# Altium schematic sheet Tiva_C_Base.SchDoc
size B
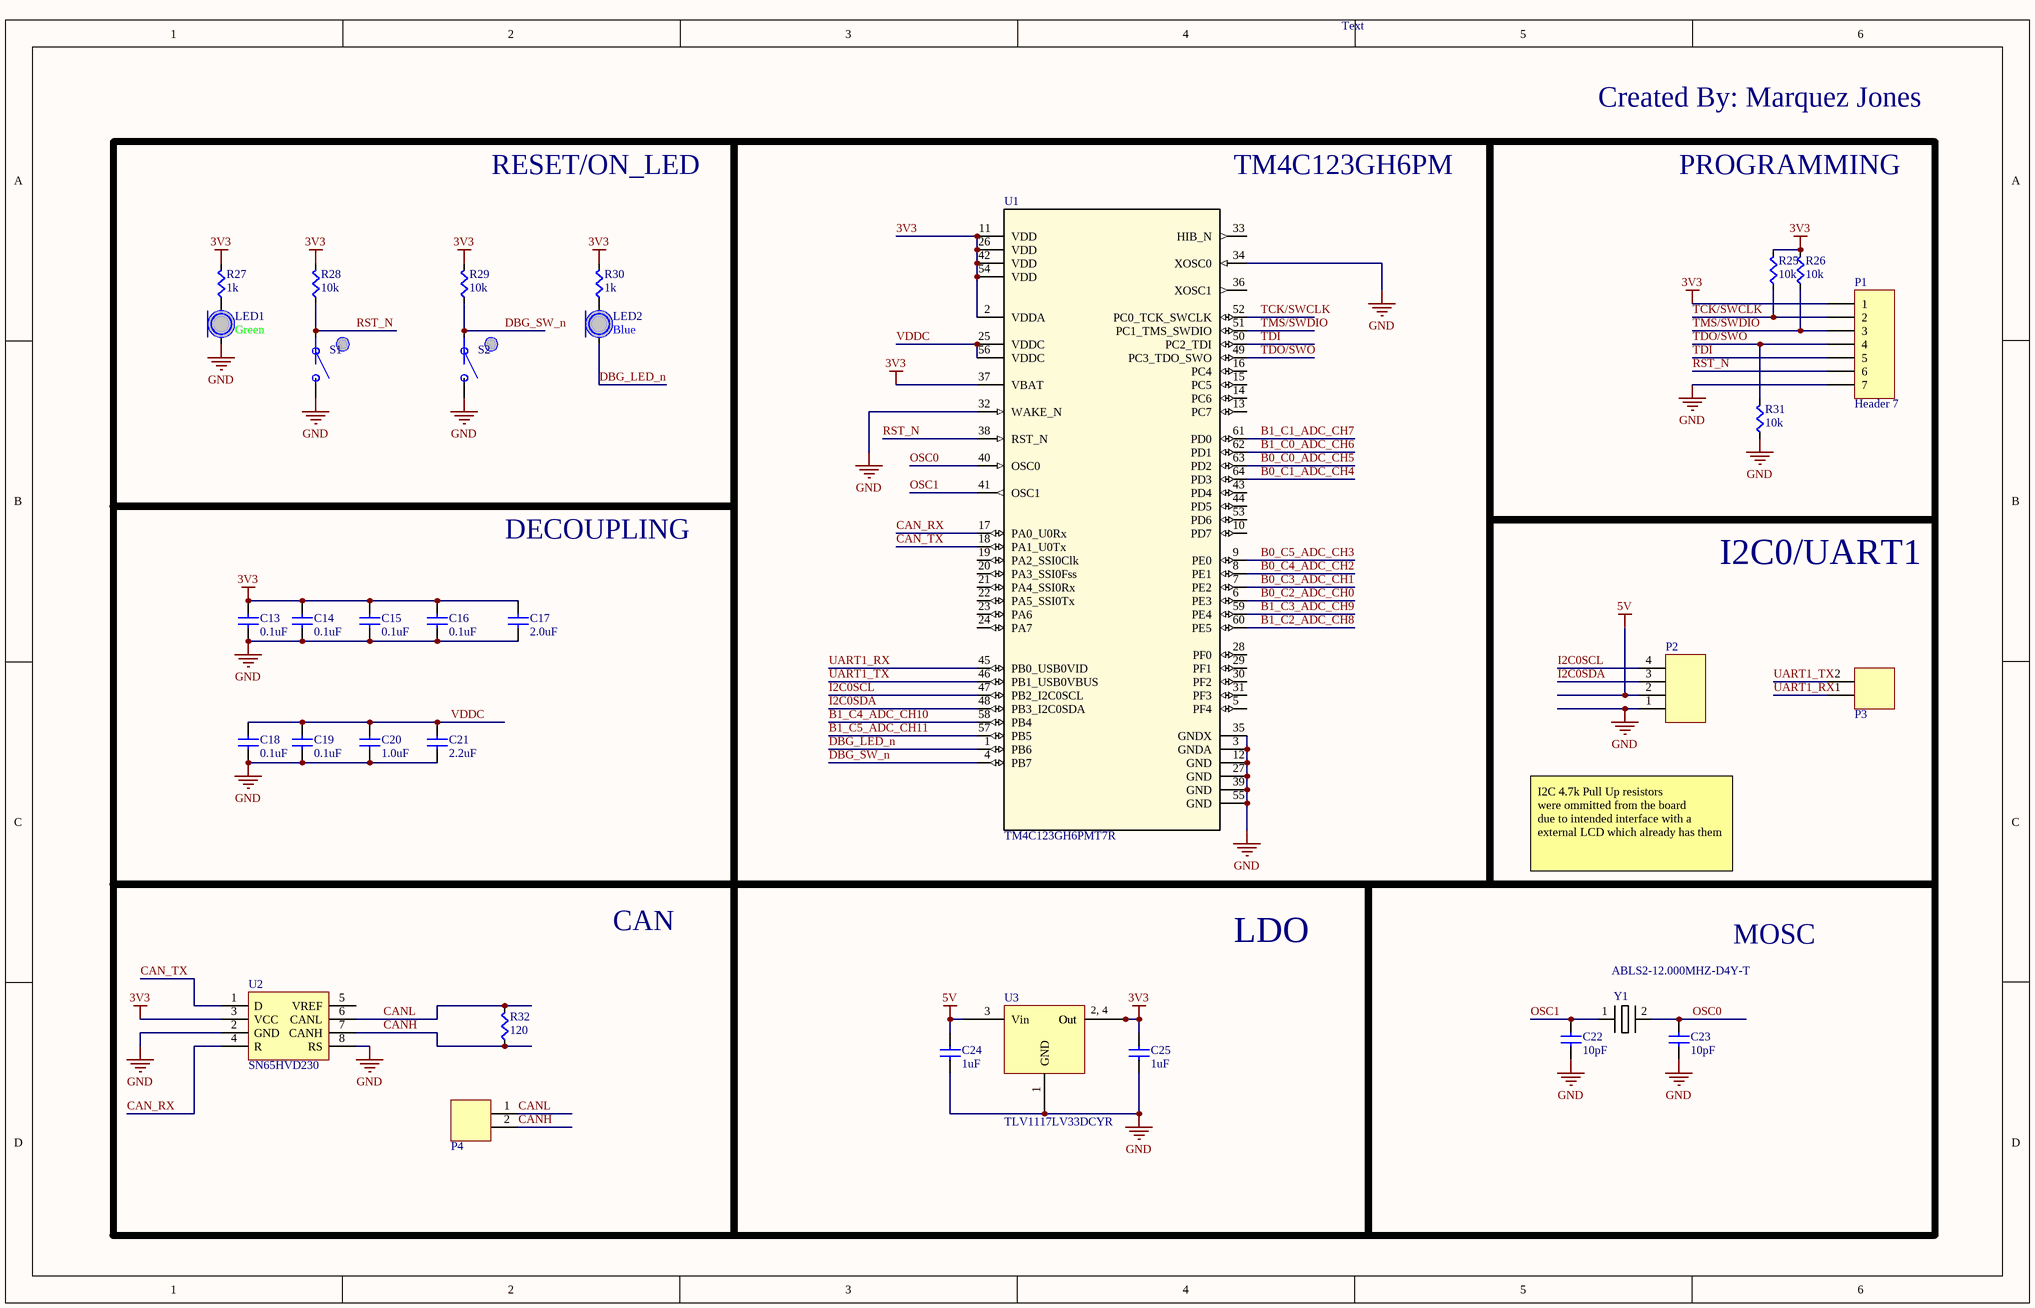
[diagram p0: Tiva_C_Base.SchDoc]

## Parts
C13  value 0.1uF  [CAPC0603]  (hidden comment: Cap)
C14  value 0.1uF  [CAPC0603]  (hidden comment: Cap)
C15  value 0.1uF  [CAPC0603]  (hidden comment: Cap)
C16  value 0.1uF  [CAPC0603]  (hidden comment: Cap)
C17  value 2.0uF  [CAPC0603]  (hidden comment: Cap)
C18  value 0.1uF  [CAPC0603]  (hidden comment: Cap)
C19  value 0.1uF  [CAPC0603]  (hidden comment: Cap)
C20  value 1.0uF  [CAPC0603]  (hidden comment: Cap)
C21  value 2.2uF  [CAPC0603]  (hidden comment: Cap)
C22  value 10pF  [CAPC0603]  (hidden comment: Cap)
C23  value 10pF  [CAPC0603]  (hidden comment: Cap)
C24  value 1uF  [CAPC0603]  (hidden comment: Cap)
C25  value 1uF  [CAPC0603]  (hidden comment: Cap)
LED1  Color: Green  [LED0603]  (hidden comment: LED)
LED2  Color: Blue  [LED0603]  (hidden comment: LED)
P1  Header 7  [HDR1X7]
P2  (no value)  [MOLEX-HDR-1X4-SHERLOCK-VERT]
P3  2-pin Vert Sherlock  [MOLEX-HDR-1X2-SHERLOCK-VERT]  (value not drawn)
P4  2-pin Vert Sherlock  [MOLEX-HDR-1X2-SHERLOCK-VERT]  (value not drawn)
R25  value 10k  [RES0603]  (hidden comment: Res)
R26  value 10k  [RES0603]  (hidden comment: Res)
R27  value 1k  [RES0603]  (hidden comment: Res)
R28  value 10k  [RES0603]  (hidden comment: Res)
R29  value 10k  [RES0603]  (hidden comment: Res)
R30  value 1k  [RES0603]  (hidden comment: Res)
R31  value 10k  [RES0603]  (hidden comment: Res)
R32  value 120  [RES0603]  (hidden comment: Res)
S1  Button  [PTS645xxxxSMTR92]  (value not drawn)
S2  Button  [PTS645xxxxSMTR92]  (value not drawn)
U1  TM4C123GH6PMT7R  [TM4C123GH6PMT7R_L]
U2  SN65HVD230  [SOIC-8pin]
U3  TLV1117LV33DCYR  [SOT23-4N]
Y1  ABLS2-12.000MHZ-D4Y-T  [HC49/US]

## Blocks framed on the sheet
RESET/ON_LED: LED1 LED2 R27-R30 S1 S2
TM4C123GH6PM: U1
PROGRAMMING: P1 R25 R26 R31
DECOUPLING: C13-C21
I2C0/UART1: P2 P3
CAN: P4 R32 U2
LDO: C24 C25 U3
MOSC: C22 C23 Y1

## Nets
3V3: C13.1(A) C14.1(A) C15.1(A) C16.1(A) C17.1(A) C25.1(A) P1.1 R25.1(A) R26.1(A) R27.1(A) R28.1(A) R29.1(A) R30.1(A) U1.2(VDDA) U1.11(VDD) U1.26(VDD) U1.37(VBAT) U1.42(VDD) U1.54(VDD) U2.3(VCC) U3.2(Out) U3.4(Out)
5V: C24.1(A) P2.2 U3.3(Vin)
GND: C13.2(B) C14.2(B) C15.2(B) C16.2(B) C17.2(B) C18.2(B) C19.2(B) C20.2(B) C21.2(B) C22.2(B) C23.2(B) C24.2(B) C25.2(B) LED1.C P1.7 P2.1 R31.2(B) S1.B S2.B U1.3(GNDA) U1.12(GND) U1.27(GND) U1.32(WAKE_N) U1.34(XOSC0) U1.35(GNDX) U1.39(GND) U1.55(GND) U2.2(GND) U2.8(RS) U3.1(GND)
B0_C0_ADC_CH5: U1.63(PD2)
B0_C1_ADC_CH4: U1.64(PD3)
B0_C2_ADC_CH0: U1.6(PE3)
B0_C3_ADC_CH1: U1.7(PE2)
B0_C4_ADC_CH2: U1.8(PE1)
B0_C5_ADC_CH3: U1.9(PE0)
B1_C0_ADC_CH6: U1.62(PD1)
B1_C1_ADC_CH7: U1.61(PD0)
B1_C2_ADC_CH8: U1.60(PE5)
B1_C3_ADC_CH9: U1.59(PE4)
B1_C4_ADC_CH10: U1.58(PB4)
B1_C5_ADC_CH11: U1.57(PB5)
CAN_RX: U1.17(PA0_U0Rx) U2.4(R)
CAN_TX: U1.18(PA1_U0Tx) U2.1(D)
CANH: P4.2 R32.2(B) U2.7(CANH)
CANL: P4.1 R32.1(A) U2.6(CANL)
DBG_LED_n: LED2.C U1.1(PB6)
DBG_SW_n: R29.2(B) S2.A U1.4(PB7)
I2C0SCL: P2.4 U1.47(PB2_I2C0SCL)
I2C0SDA: P2.3 U1.48(PB3_I2C0SDA)
OSC0: C23.1(A) U1.40(OSC0) Y1.2
OSC1: C22.1(A) U1.41(OSC1) Y1.1
RST_N: P1.6 R28.2(B) S1.A U1.38(RST_N)
TCK/SWCLK: P1.2 R25.2(B) U1.52(PC0_TCK_SWCLK)
TDI: P1.5 U1.50(PC2_TDI)
TDO/SWO: P1.4 R31.1(A) U1.49(PC3_TDO_SWO)
TMS/SWDIO: P1.3 R26.2(B) U1.51(PC1_TMS_SWDIO)
UART1_RX: P3.1 U1.45(PB0_USB0VID)
UART1_TX: P3.2 U1.46(PB1_USB0VBUS)
VDDC: C18.1(A) C19.1(A) C20.1(A) C21.1(A) U1.25(VDDC) U1.56(VDDC)
NetLED1_A: LED1.A R27.2(B)
NetLED2_A: LED2.A R30.2(B)

Not connected (* = marked no-connect by the designer): U1 5(PF4) 10(PD7) 13(PC7) 14(PC6) 15(PC5) 16(PC4) 19(PA2_SSI0Clk) 20(PA3_SSI0Fss) 21(PA4_SSI0Rx) 22(PA5_SSI0Tx) 23(PA6) 24(PA7) 28(PF0) 29(PF1) 30(PF2) 31(PF3) 33(HIB_N) 36(XOSC1) 43(PD4) 44(PD5) 53(PD6); U2 5(VREF)

## Notes on the sheet
- Text
- Created By: Marquez Jones
- I2C 4.7k Pull Up resistors
  were ommitted from the board
  due to intended interface with a
  external LCD which already has them
- (in symbol TLV1117LV33DCYR) 2, 4

## Library data of the parts
C24 C25 = Cap: Manufacturer Part Number: C0603C105K8PACTU; Supplier 1: Digi-Key; Supplier Part Number 1: 399-3118-1-ND
P1 = Header 7: Header, 7-Pin; LatestRevisionDate: 17-Jul-2002; LatestRevisionNote: Re-released for DXP Platform.; Publisher: Altium Limited
P2 = MOLEX-HDR-1x4-SHERLOCK_VERT: Header, Molex, 2mm Pitch Sherlock Header, Single Row, Vertical, 4 Circuits, Length 3.3mm, 0353620450; Manufacturer Part Number: *; Order Part Number: *
P3 P4 = MOLEX-HDR-1x2-SHERLOCK_VERT: Header, Molex, 2mm Pitch Sherlock Header, Single Row, Vertical, 2 Circuits, Length 3.3mm, 0353620250; Manufacturer Part Number: *; Order Part Number: *
S1 S2 = Button: SPST Button; Supplier 1: Digi-Key; Supplier Part Number 1: CKN9087CT-ND
U1 = TM4C123GH6PMT7R: Imported; PartNumber: TM4C123GH6PMTR; Manufacturer: Texas Instruments; CompType: IC; PIN_COUNT: 64; Application_BuildNumber: *; Alternate_PartNumber: TM4C123GH6PMT; PackageReference: PM0064A; MountType: SMT; RoHS: Y; RefDes: RefDes; TYPE: TYPE; Value: Value
U2 = SN65HVD230: 3.3V CAN Bus Transceiver
U3 = TLV1117LV33DCYR: IC REG LINEAR 3.3V 1A SOT223-4; Digi-Key Part Number: 296-28778-1-ND
Y1 = ABLS2-12.000MHZ-D4Y-T: 12MHz ±30ppm Crystal 18pF 50 Ohm -40°C ~ 85°C Surface Mount HC49/US; Supplier 1: Digi-Key; Supplier Part Number 1: 535-9869-1-ND
C13-C23 = Cap: Supplier 1: Digi-Key; Supplier Part Number 1: 1276-1000-1-ND
LED1 LED2 = LED: Supplier 1: Digi-Key; Supplier Part Number 1: 754-1122-1-ND
R25-R32 = Res: Supplier 1: Digi-Key; Supplier Part Number 1: RMCF0603JT10K0CT-ND